# EAGLE design Add4andGain (EAGLE 6.4)
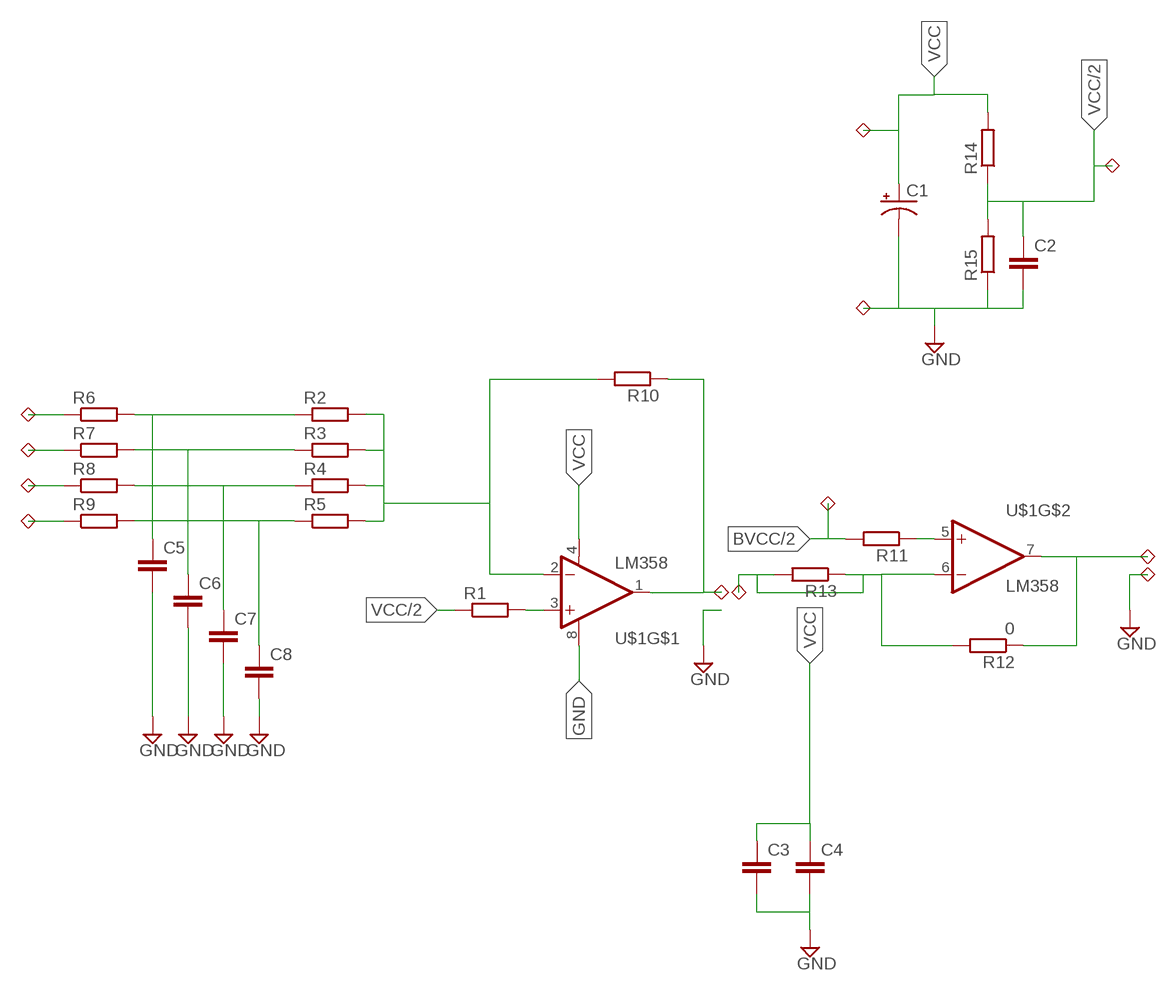
[diagram p0: schematic, sheet 1]

## Parts
C1  CPOL-USSMCE  [SMC_E]
C2  C-EUC0805  [C0805]
C3  C-EUC0805  [C0805]
C4  C-EUC0805  [C0805]
C5  C-EUC0805  [C0805]
C6  C-EUC0805  [C0805]
C7  C-EUC0805  [C0805]
C8  C-EUC0805  [C0805]
R1  R-EU_R0603  [R0603]
R2  R-EU_R0603  [R0603]
R3  R-EU_R0603  [R0603]
R4  R-EU_R0603  [R0603]
R5  R-EU_R0603  [R0603]
R6  R-EU_R0603  [R0603]
R7  R-EU_R0603  [R0603]
R8  R-EU_R0603  [R0603]
R9  R-EU_R0603  [R0603]
R10  R-EU_R0603  [R0603]
R11  R-EU_R0603  [R0603]
R12  0  R-EU_R0603  [R0603]
R13  R-EU_R0603  [R0603]
R14  R-EU_R0603  [R0603]
R15  R-EU_R0603  [R0603]
U$1  LM358  [SO08]
U$2  1PIN_SM  [THUMBNAIL_SM]
U$3  1PIN_SM  [THUMBNAIL_SM]
U$4  1PIN_SM  [THUMBNAIL_SM]
U$5  1PIN_SM  [THUMBNAIL_SM]
U$6  1PIN_SM  [THUMBNAIL_SM]
U$7  1PIN_SM  [THUMBNAIL_SM]
U$8  1PIN_SM  [THUMBNAIL_SM]
U$9  1PIN_SM  [THUMBNAIL_SM]
U$10  1PIN_SM  [THUMBNAIL_SM]
U$12  1PIN_SM  [THUMBNAIL_SM]
U$15  1PIN_SM  [THUMBNAIL_SM]
U$16  1PIN_SM  [THUMBNAIL_SM]

## Nets
AIN+: R1.2 U$1.3(+IN)
AIN-: R2.2 R3.2 R4.2 R5.2 R10.2 U$1.2(-IN)
BIN+: R11.1 U$1.5(+IN)
BIN-: R12.2 R13.1 R13.2 U$1.6(-IN) U$9.P$1
BVCC/2: R11.2 U$6.P$1
GND: C1.- C2.2 C3.2 C4.2 C5.2 C6.2 C7.2 C8.2 R15.1 U$1.8(V+) U$7.P$1 U$16.P$1
N$1: R6.1 U$2.P$1
N$3: R12.1 U$1.7(OUT) U$15.P$1
N$4: R7.1 U$3.P$1
N$5: R8.1 U$4.P$1
N$6: R9.1 U$5.P$1
N$7: C5.1 R2.1 R6.2
N$8: C6.1 R3.1 R7.2
N$9: C7.1 R4.1 R8.2
N$10: C8.1 R5.1 R9.2
N$14: R10.1 U$1.1(OUT) U$8.P$1
VCC: C1.+ C3.1 C4.1 R14.2 U$1.4(V-) U$12.P$1
VCC/2: C2.1 R1.1 R14.1 R15.2 U$10.P$1

## Library data of the parts
C1 = rcl:CPOL-US: POLARIZED CAPACITOR, American symbol
C2-C8 = rcl:C-EU: CAPACITOR, European symbol
R1-R15 = rcl:R-EU_: RESISTOR, European symbol
U$1 = synth_design:LM358
U$2-U$10 U$12 U$15 U$16 = multi-smt:1PIN_SM

## Board
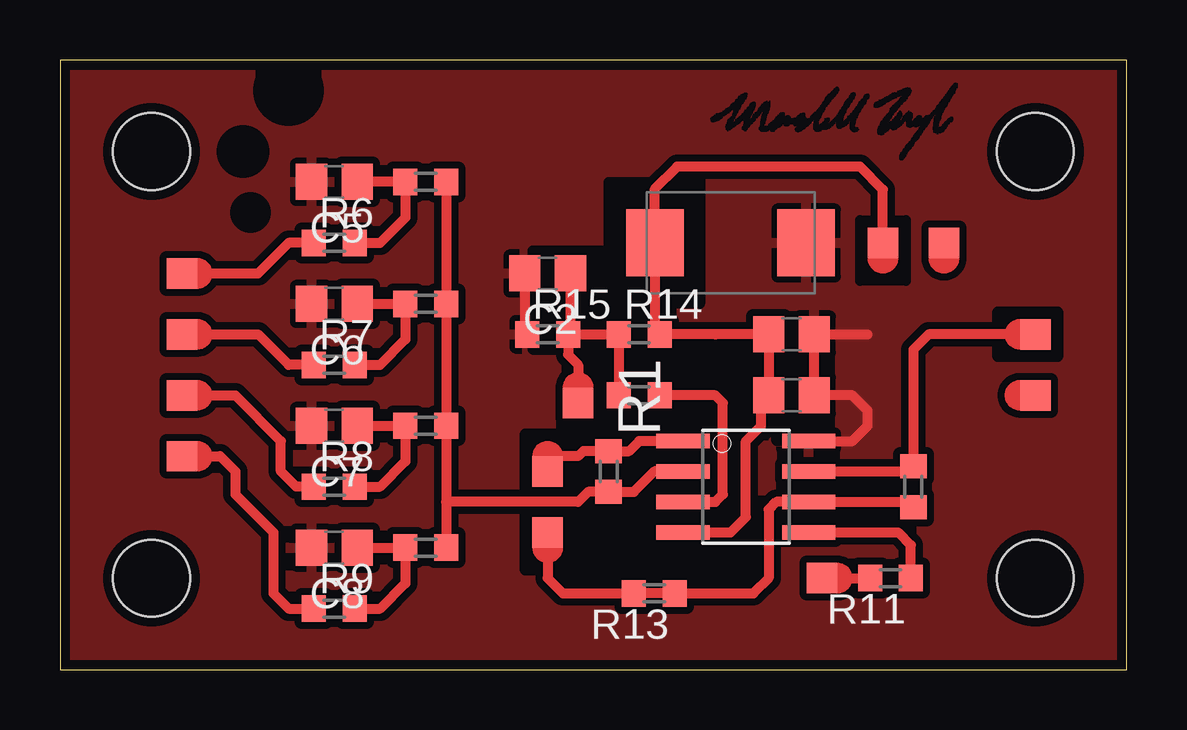
[diagram p1: board, top side]

Size 44.45 x 25.4 mm. Coordinates in mm from the lower left corner, seen from the top.
Outline: 0,0 44.45,0 44.45,25.4 0,25.4 0,0
Copper layers (1*16): Top 0.035mm / dielectric 1.5mm / Bottom 0.035mm
Design rules "default *": minimum track width 10mil, minimum drill 24mil, track to track 12mil, track to pad 12mil, pad to pad 12mil, via to via 12mil, smd to smd 8mil, copper to edge 16mil, drill to drill 8mil, minimum pad ring 10mil, minimum via ring 8mil, stop-mask expansion 4mil, vias tented up to drill 0mil, thermal gap 10mil
Holes 3.2 mm at 3.81,3.81 3.81,21.59 40.64,21.59 40.64,3.81
tRestrict: area 19.4,4.1 to 21.3,9.8; area 19.7,13.3 to 22.9,17.5; area 22.9,15.2 to 26.7,20.3; area 39.1,13 to 41.6,14.9; area 29.8,9.5 to 32.1,14; area 8.3,22.9 to 10.8,25.4; area 6.7,20.7 to 8.5,22.5; area 7.3,18.4 to 8.6,19.7; area 33.3,16.2 to 35.2,18.7; area 35,21.2 to 35.1,21.2; area 35,21.2 to 35.1,21.3; area 35,21.3 to 35.2,21.3; 813 more areas

### Footprints (pad centres in the part's own frame; a part is rotated, then mirrored left to right if it is on the bottom)
SMC_E = smd 2.4 x 2.8: + -3.15,0; - 3.15,0
C0805 = smd 1.3 x 1.5: 1 -0.95,0; 2 0.95,0
R0603 = smd 1 x 1.1: 1 -0.85,0; 2 0.85,0
SO08 = smd 0.61 x 2.21: 1 -1.905,-2.616; 2 -0.635,-2.616; 3 0.635,-2.616; 4 1.905,-2.616; 5 1.905,2.616; 6 0.635,2.616; 7 -0.635,2.616; 8 -1.905,2.616
THUMBNAIL_SM = smd 1.27 x 1.27: P$1 0,0

### Placement (x,y rotation side)
C1  27.94,17.78 0 top
C2  20.32,16.51 180 top
C3  30.48,11.43 0 top
C4  30.48,13.97 0 top
C5  11.43,20.32 180 top
C6  11.43,15.24 180 top
C7  11.43,10.16 180 top
C8  11.43,5.08 180 top
R1  24.13,11.43 0 top
R2  15.24,20.32 0 top
R3  15.24,15.24 0 top
R4  15.24,10.16 0 top
R5  15.24,5.08 0 top
R6  11.43,17.78 0 top
R7  11.43,12.7 0 top
R8  11.43,7.62 0 top
R9  11.43,2.54 0 top
R10  22.86,8.26 270 top
R11  34.61,3.81 180 top
R12  35.56,7.62 270 top
R13  24.77,3.17 180 top
R14  24.13,13.97 0 top
R15  20.32,13.97 0 top
U$1  28.57,7.62 270 top
U$2  5.08,16.51 0 top
U$3  5.08,13.97 0 top
U$4  5.08,11.43 0 top
U$5  5.08,8.89 0 top
U$6  31.75,3.81 0 top
U$7  36.83,17.78 270 top
U$8  20.32,8.26 90 top
U$9  20.32,5.71 270 top
U$10  21.59,11.11 90 top
U$12  34.29,17.78 270 top
U$15  40.64,13.97 180 top
U$16  40.64,11.43 180 top

### Tracks (layer width: path | path; a pad name or v marks a point on that pad's centre or on a via)
AIN+
  Top 0.406: U$1.3 27.3,6.99 27.62,7.3 27.62,11.11 27.3,11.43 R1.2
AIN-
  Top 0.406: U$1.2 24.77,8.26 23.91,7.41 R10.2 22.01,7.41 21.59,6.99 16.09,6.99 | R2.2 R3.2 R4.2 16.09,6.99 | 16.09,6.99 R5.2
BIN+
  Top 0.406: R11.1 35.46,5.18 34.92,5.71 U$1.5
BIN-
  Top 0.406: R12.2 35.56,6.99 U$1.6 29.84,6.99 29.53,6.67 29.53,3.81 28.89,3.17 R13.1 R13.2 20.95,3.17 20.32,3.81 U$9.P$1
BVCC/2
  Top 0.406: U$6.P$1 R11.2
GND
  Top 0.406: 31.43,9.53 U$1.8 33.02,9.53 33.66,10.16 33.66,10.79 33.02,11.43 C3.2 C4.2 33.66,13.97 | C2.2 19.37,14.07 R15.1
  pour Top: 0,25.4 0,0 44.45,0 44.45,25.4
  pour Top: 26.21,25.4 26.24,21.21 38.05,21.21 37.97,25.4
N$1
  Top 0.406: U$2.P$1 8.26,16.51 9.53,17.78 R6.1
N$3
  Top 0.406: U$1.7 35.56,8.26 R12.1 35.56,13.34 36.2,13.97 U$15.P$1
N$4
  Top 0.406: U$3.P$1 8.26,13.97 9.53,12.7 R7.1
N$5
  Top 0.406: U$4.P$1 7.3,11.43 9.21,9.53 9.21,8.26 9.84,7.62 R8.1
N$6
  Top 0.406: U$5.P$1 6.67,8.89 7.3,8.26 7.3,7.3 8.89,5.71 8.89,3.17 9.53,2.54 R9.1
N$7
  Top 0.406: C5.1 R2.1 14.39,18.84 13.34,17.78 R6.2
N$8
  Top 0.406: R7.2 13.34,12.7 14.39,13.76 R3.1 C6.1
N$9
  Top 0.406: R8.2 13.34,7.62 14.39,8.68 R4.1 C7.1
N$10
  Top 0.406: R9.2 13.34,2.54 14.39,3.6 R5.1 C8.1
N$14
  Top 0.406: U$1.1 24.13,9.53 23.71,9.11 R10.1 21.8,9.11 21.59,8.89 20.32,8.89 U$8.P$1
VCC
  Top 0.406: C3.1 C4.1 27.3,13.97 | C3.1 29.21,11.43 | U$1.4 27.94,5.71 28.57,6.35 28.57,9.53 29.21,10.16 29.21,11.11 C3.1 | 27.3,13.97 R14.2 | 27.3,13.97 24.79,13.99 C1.+ 24.79,20.03 25.72,20.95 33.34,20.95 34.29,20 U$12.P$1
VCC/2
  Top 0.406: R15.2 R14.1 R1.1 | R15.2 21.17,13.12 21.59,12.7 U$10.P$1 | C2.1 21.27,14.07 R15.2